# EAGLE design amc6821-breakout-v2.0 (EAGLE 9.6.2)
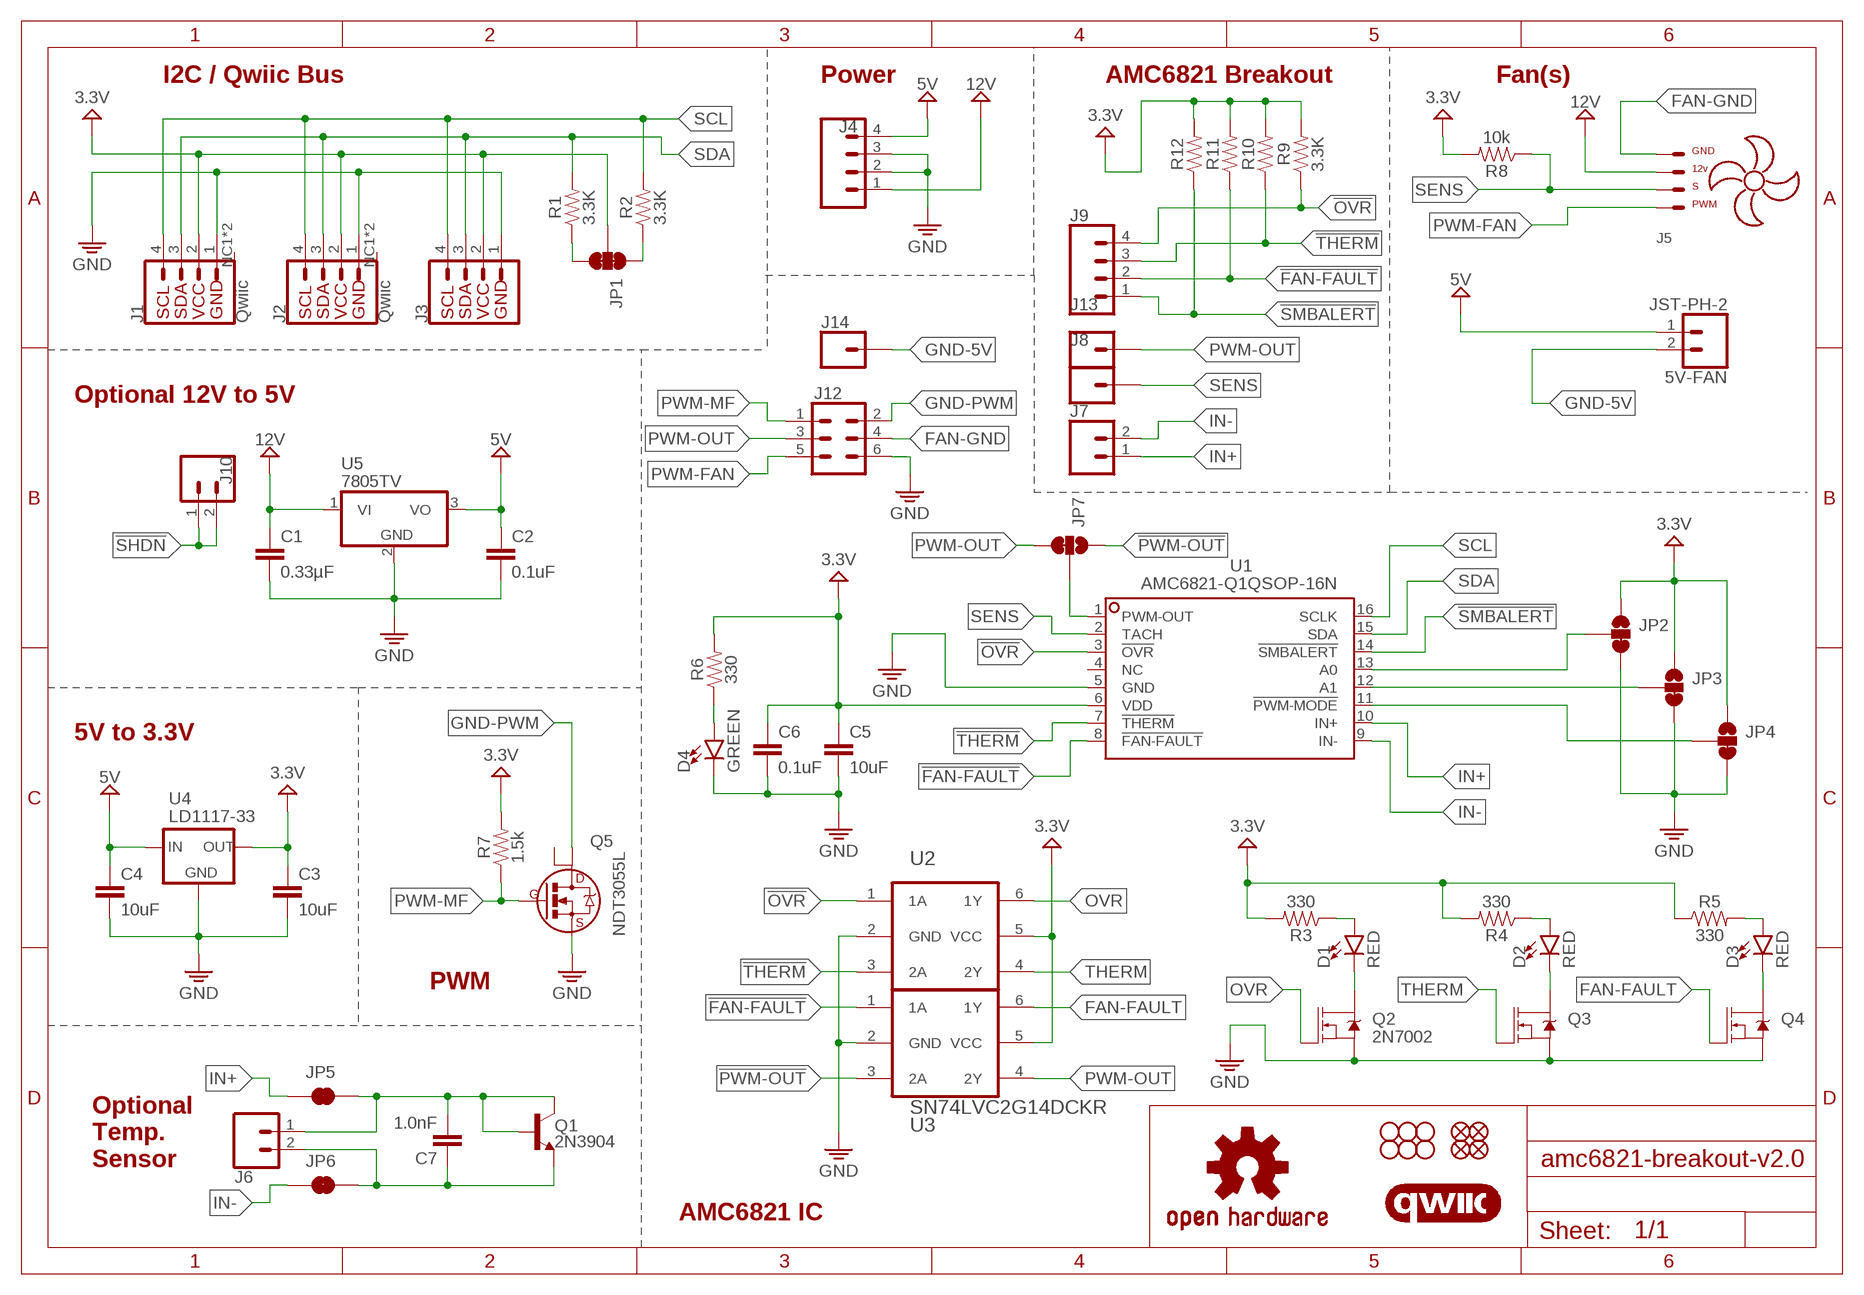
[diagram p0: schematic, sheet 1]

## Parts
5V-FAN  JST-PH-2  [JST-PH2]
C1  0.33µF  0.33UF/330NF-0805-50V-10%  [0805]
C2  0.1uF  0.1UF-0603-25V-5%  [0603]
C3  10uF  10UF-0603-6.3V-20%  [0603]
C4  10uF  10UF-0603-6.3V-20%  [0603]
C5  10uF  10UF-0603-6.3V-20%  [0603]
C6  0.1uF  0.1UF-0603-25V-5%  [0603]
C7  1.0nF  1.0NF/1000PF-0402_TIGHT-50V-10%  [0402-TIGHT]
D1  RED  LED-RED0603  [LED-0603]
D2  RED  LED-RED0603  [LED-0603]
D3  RED  LED-RED0603  [LED-0603]
D4  GREEN  LED-GREEN0603  [LED-0603]
FD1  FIDUCIALUFIDUCIAL  [FIDUCIAL-MICRO]
FD2  FIDUCIALUFIDUCIAL  [FIDUCIAL-MICRO]
FD3  FIDUCIALUFIDUCIAL  [FIDUCIAL-MICRO]
FD4  FIDUCIALUFIDUCIAL  [FIDUCIAL-MICRO]
H1  STAND-OFF  [STAND-OFF]
H2  STAND-OFF  [STAND-OFF]
H3  STAND-OFF  [STAND-OFF]
H4  STAND-OFF  [STAND-OFF]
H5  STAND-OFF  [STAND-OFF]
H6  STAND-OFF  [STAND-OFF]
J1  Qwiic  QWIIC_CONNECTOR  [JST04_1MM_VERT]
J2  Qwiic  QWIIC_CONNECTOR  [JST04_1MM_VERT]
J3  I2C_STANDARD  [1X04]
J4  CONN_04SCREW  [SCREWTERMINAL-3.5MM-4]
J5  KK-254-4KK-254  [MOLEX_47053-1000]
J6  CONN_02  [1X02]
J7  CONN_02  [1X02]
J8  CONN_01  [1X01]
J9  CONN_04PTH  [1X04]
J10  CONN_021X02_NO_SILK  [1X02_NO_SILK]
J12  CONN_03X2NO_SILK  [2X3-NS]
J13  CONN_01  [1X01]
J14  CONN_01  [1X01]
JP1  JUMPER-SMT_3_2-NC_TRACE_SILK  [SMT-JUMPER_3_2-NC_TRACE_SILK]
JP2  JUMPER-SMT_3_1-NC_TRACE_SILK  [SMT-JUMPER_3_1-NC_TRACE_SILK]
JP3  JUMPER-SMT_3_1-NC_TRACE_SILK  [SMT-JUMPER_3_1-NC_TRACE_SILK]
JP4  JUMPER-SMT_3_1-NC_TRACE_SILK  [SMT-JUMPER_3_1-NC_TRACE_SILK]
JP5  JUMPER-SMT_2_NC_TRACE_SILK  [SMT-JUMPER_2_NC_TRACE_SILK]
JP6  JUMPER-SMT_2_NC_TRACE_SILK  [SMT-JUMPER_2_NC_TRACE_SILK]
JP7  JUMPER-SMT_3_1-NC_TRACE_SILK  [SMT-JUMPER_3_1-NC_TRACE_SILK]
LOGO1  OSHW-LOGOS  [OSHW-LOGO-S]
LOGO2  QWIIC_LOGO_6MM  [QWIIC_6MM]
Q1  2N3904  TRANS_NPN-MMBTA42  [SOT23-3]
Q2  2N7002  MOSFET-NCH-2N7002PW  [SOT323]
Q3  310mA/60V/1.6Ω  MOSFET-NCH-2N7002PW  [SOT323]
Q4  310mA/60V/1.6Ω  MOSFET-NCH-2N7002PW  [SOT323]
Q5  NDT3055L  [SOT223]
R1  3.3K  RESISTOR0805  [0805]
R2  3.3K  RESISTOR0805  [0805]
R3  330  RESISTOR0805  [0805]
R4  330  RESISTOR0805  [0805]
R5  330  RESISTOR0805  [0805]
R6  330  RESISTOR0805  [0805]
R7  1.5k  1.5KOHM-0603-1/10W-1%  [0603]
R8  10k  10KOHM-0603-1/10W-1%  [0603]
R9  3.3K  RESISTOR0805  [0805]
R10  3.3K  RESISTOR0805  [0805]
R11  3.3K  RESISTOR0805  [0805]
R12  3.3K  RESISTOR0805  [0805]
U1  AMC6821-Q1QSOP-16N  [QSOP-16N]
U2  SN74LVC2G14DCKR  [SOT65P210X110-6N]
U3  SN74LVC2G14DCKR  [SOT65P210X110-6N]
U4  LD1117-33  V_REG_LD1117VXXLD1117-SMD  [SOT223]
U5  7805TV  [TO220V]

## Nets
3V3: C3.1 C5.1 C6.1 J1.2 J2.2 J3.2 JP1.2 JP2.1 JP3.1 JP4.1 R3.2 R4.2 R5.1 R6.2 R7.2 R8.2 R9.2 R10.2 R11.2 R12.2 U1.6(VDD) U2.5(VCC) U3.5(VCC) U4.2(OUT) ; supply symbol labelled 3.3V
5V: 5V-FAN.1 C2.1 C4.1 J4.4 U4.3(IN) U5.3(VO)
12V: C1.1 J4.1 J5.2:+12VDC U5.1(VI)
!FAN-FAULT: J9.2 R11.1 U1.8(!FAN-FAULT) U3.1(1A)
!OVR: J9.4 R9.1 U1.3(!OVR) U2.1(1A)
!PWM-OUT: JP7.1 U3.3(2A)
!SHDN: J10.1 J10.2
!SMBALERT: J9.1 R12.1 U1.14(!SMBALERT)
!THERM: J9.3 R10.1 U1.7(!THERM) U2.3(2A)
FAN-FAULT: Q4.1(G) U3.6(1Y)
FAN-GND: J5.1:GND J12.4
GND: C1.2 C2.2 C3.2 C4.2 C5.2 C6.2 D4.C J1.1 J2.1 J3.1 J4.2 J4.3 J12.6 JP2.3 JP3.3 JP4.3 Q2.2(S) Q3.2(S) Q4.2(S) Q5.S U1.5(GND) U2.2(GND) U3.2(GND) U4.1(GND) U5.2(GND)
GND-5V: 5V-FAN.2 J14.1
GND-PWM: J12.2 Q5.D
IN+: J7.1 JP5.1 U1.10(IN+)
IN-: J7.2 JP6.1 U1.9(IN-)
N$1: JP2.2 U1.13(A0)
N$2: C7.2 J6.1 JP5.2 Q1.1(B) Q1.3(C)
N$3: JP1.3 R1.1
N$4: JP1.1 R2.1
N$5: JP4.2 U1.11(!PWM-MODE)
N$6: JP3.2 U1.12(A1)
N$7: C7.1 J6.2 JP6.2 Q1.2(E)
N$8: D4.A R6.1
N$9: D3.A R5.2
N$10: D3.C Q4.3(D)
N$11: D1.A R3.1
N$14: D1.C Q2.3(D)
N$15: D2.C Q3.3(D)
N$16: D2.A R4.1
N$30: JP7.2 U1.1(PWM-OUT)
OVR: Q2.1(G) U2.6(1Y)
PWM-FAN: J5.4:PWM J12.5
PWM-MF: J12.1 Q5.G R7.1
PWM-OUT: J12.3 J13.1 JP7.3 U3.4(2Y)
SCL: J1.4 J2.4 J3.4 R2.2 U1.16(SCLK)
SDA: J1.3 J2.3 J3.3 R1.2 U1.15(SDA)
SENS: J5.3:TACH J8.1 R8.1 U1.2(TACH)
THERM: Q3.1(G) U2.4(2Y)
Unconnected: J1.NC1(SH) J1.NC2(SH) J2.NC1(SH) J2.NC2(SH) Q5.D2 U1.4(NC)

## Notes on the sheet
- I2C / Qwiic Bus | Power | AMC6821 Breakout | Fan(s)
- Optional 12V to 5V
- 5V to 3.3V
- PWM
- Optional
  Temp.
  Sensor
- AMC6821 IC

## Library data of the parts
5V-FAN = VinoRodrigues_Custom_Eagle:JST-PH-2
C1 = SparkFun-Capacitors:0.33UF/330NF: 0.33µF/330nF ceramic capacitors A capacitor is a passive two-terminal electrical component used to store electrical energy temporarily in an electric field.; PROD_ID: CAP-08469
C2 C6 = SparkFun-Capacitors:0.1UF: 0.1µF ceramic capacitors A capacitor is a passive two-terminal electrical component used to store electrical energy temporarily in an electric field.; PROD_ID: CAP-08604
C3-C5 = SparkFun-Capacitors:10UF: 10.0µF ceramic capacitors A capacitor is a passive two-terminal electrical component used to store electrical energy temporarily in an electric field.; PROD_ID: CAP-11015
C7 = SparkFun-Capacitors:1.0NF/1000PF: 1nF/1,000pF ceramic capacitors A capacitor is a passive two-terminal electrical component used to store electrical energy temporarily in an electric field.; PROD_ID: CAP-14280
D1-D3 = SparkFun-LED:LED-RED: Red SMD LED Used in manufacturing of most products at SparkFun Packages: 0603 - SMD 0603 package [Product Link] <http://docs.avagotech.com/docs/AV02-0551EN> 0603 SMART - SMD 0603 SMART package ( more efficient and expensive)[Product Link] <http://www.osram-os.com/Graphics/XPic2/00077099_0.pdf> 1206 - SMD1206 package [Product Link] <https://www.sparkfun.com/datasheets/DevTools/LilyPad/Q150OVS4.pdff> SparkFun Products: Pro Mini 328 -5V <https://www.sparkfun.com/products/821> RedBoard <https://www.sparkfun.com/products/12757> IOIO-OTG <https://www.sparkfun.com/products/13613>; PROD_ID: DIO-00819
D4 = SparkFun-LED:LED-GREEN: Green SMD LED Used in manufacturing of various products at SparkFun Packages: 0603 - SMD 0603 package [Product Link] <http://www.futureelectronics.com/en/technologies/semiconductors/optoelectronics/leds/Pages/9894312-LTST-C190GKT.aspx?CrossPart=HSMG-C190&IM=0> LilyPad 1206 - SMD1206 LilyPad package [Product Link] <http://www.futureelectronics.com/en/Technologies/Product.aspx?ProductID=IN150NGHARVATEKCORPORATION2049943&IM=0> 1206 - SMD1206 package [Product Link] <http://www.futureelectronics.com/en/technologies/semiconductors/optoelectronics/leds/Pages/8315665-LTST-C150KGKT.aspx?IM=0> 1206 Bottom Mount -SMD 1206 Bottom Mount [Product Link] <http://www.digikey.com/product-detail/en/lite-on-inc/LTST-C230KGKT/160-1456-1-ND/386854> SparkFun Products: Pro Mini 328 -5V <https://www.sparkfun.com/products/821> RedBoard <https://www.sparkfun.com/products/12757> MP3 Trigger <https://www.sparkfun.com/products/13720> Makey Makey <https://www.sparkfun.com/products/11076>; PROD_ID: DIO-00821
FD1-FD4 = SparkFun-Aesthetics:FIDUCIAL: Fiducial Alignment Points Point-of-reference for pick-and-place machines and other optical instruments.
H1-H6 = SparkFun-Hardware:STAND-OFF: Stand Off Drill holes for mechanically mounting via screws, standoffs, etc. Note: Use the keepout ring to avoid running the screw head into surrounding components. Variant Overviews STAND-OFF - Mechanical footprint for a #4 phillips button head screw. STAND-OFF-TIGHT - Mechanical footprint for a #4 phillips button head screw, Example SparkFun Products Screw - Phillips Head (1/4", 4-40, 10 pack) <https://www.sparkfun.com/products/10453> (PRT-10453) Screw - Phillips Head (1/2", 4-40, 10 pack) <https://www.sparkfun.com/products/10452> (PRT-10452) Screw - Phillips Head (3/4", 4-40, 10 pack) <https://www.sparkfun.com/products/10451> (PRT-10451) Screw - Phillips Head (1", 4-40, 10 pack) <https://www.sparkfun.com/products/10450> (PRT-10450)
J1 J2 = VinoRodrigues_Custom_Eagle:QWIIC_CONNECTOR: SparkFun I2C Standard Qwiic Connector An SMD 1mm pitch JST connector makes it easy and quick (get it? Qwiic?) to connect I2C devices to each other. The Qwiic system <http://www.sparkfun.com/qwiic> enables fast and solderless connection between popular platforms and various sensors and actuators. We carry 200mm <https://www.sparkfun.com/products/14204>, 100mm <https://www.sparkfun.com/products/14205>, 50mm <https://www.sparkfun.com/products/14206>, and breadboard friendly <https://www.sparkfun.com/products/14207> Qwiic cables. We also offer 10 pcs strips <https://www.sparkfun.com/products/14323> the SMD connectors.; PROD_ID: CONN-14483; VALUE: Vertical Qwiic Connector
J3 = SparkFun-Connectors:I2C_STANDARD: SparkFun I2C Standard Pinout Header SparkFun has standardized on a pinout for all I2C based sensor breakouts. This pinout allows I2C boards to be plugged directly into the headers on Arduino Uno compatible boards, and to be daisy chained easily. Example SparkFun Products: SparkFun Atmospheric Sensor Breakout - BME280 <https://www.sparkfun.com/products/13676> SparkFun Altitude/Pressure Sensor Breakout - MPL3115A2 <https://www.sparkfun.com/products/11084> SparkFun TOF Range Finder Sensor - VL6180 <https://www.sparkfun.com/products/12785>
J4 = SparkFun-Connectors:CONN_04: Multi connection point. Often used as Generic Header-pin footprint for 0.1 inch spaced/style header connections On any of the 0.1 inch spaced packages, you can populate with these: Break Away Headers - Straight <https://www.sparkfun.com/products/116> (PRT-00116) Break Away Male Headers - Right Angle <https://www.sparkfun.com/products/553> (PRT-00553) Female Headers <https://www.sparkfun.com/products/115> (PRT-00115) Break Away Headers - Machine Pin <https://www.sparkfun.com/products/117> (PRT-00117) Break Away Female Headers - Swiss Machine Pin <https://www.sparkfun.com/products/743> (PRT-00743) For SCREWTERMINALS and SPRING TERMINALS visit here: Screw Terimnals on SparkFun.com <https://www.sparkfun.com/search/results?term=Screw+Terminals> (5mm/3.5mm/2.54mm spacing) This device is also useful as a general connection point to wire up your design to another part of your project. Our various solder wires solder well into these plated through hole pads. Hook-Up Wire - Assortment (Stranded, 22 AWG) <https://www.sparkfun.com/products/11375> (PRT-11375) Hook-Up Wire - Assortment (Solid Core, 22 AWG) <https://www.sparkfun.com/products/11367> (PRT-11367) View the entire wire category on our website here <https://www.sparkfun.com/categories/141> Special notes: Molex polarized connector foot print use with SKU : PRT-08231 with associated crimp pins and housings. 1MM SMD Version SKU: PRT-10208; PROD_ID: CONN-14485
J5 = VinoRodrigues_Custom_Eagle:KK-254-4
J6 J7 J10 = SparkFun-Connectors:CONN_02: Multi connection point. Often used as Generic Header-pin footprint for 0.1 inch spaced/style header connections On any of the 0.1 inch spaced packages, you can populate with these: Break Away Headers - Straight <https://www.sparkfun.com/products/116> (PRT-00116) Break Away Male Headers - Right Angle <https://www.sparkfun.com/products/553> (PRT-00553) Female Headers <https://www.sparkfun.com/products/115> (PRT-00115) Break Away Headers - Machine Pin <https://www.sparkfun.com/products/117> (PRT-00117) Break Away Female Headers - Swiss Machine Pin <https://www.sparkfun.com/products/743> (PRT-00743) For SCREWTERMINALS and SPRING TERMINALS visit here: Screw Terimnals on SparkFun.com <https://www.sparkfun.com/search/results?term=Screw+Terminals> (5mm/3.5mm/2.54mm spacing) This device is also useful as a general connection point to wire up your design to another part of your project. Our various solder wires solder well into these plated through hole pads. Hook-Up Wire - Assortment (Stranded, 22 AWG) <https://www.sparkfun.com/products/11375> (PRT-11375) Hook-Up Wire - Assortment (Solid Core, 22 AWG) <https://www.sparkfun.com/products/11367> (PRT-11367) View the entire wire category on our website here <https://www.sparkfun.com/categories/141> Special notes: Molex polarized connector foot print use with: PRT-08233 with associated crimp pins and housings. 2.54_SCREWTERM for use with PRT-10571. 3.5mm Screw Terminal footprints for PRT-08084 5mm Screw Terminal footprints for use with PRT-08432
J8 J13 J14 = SparkFun-Connectors:CONN_01: Single connection point. Often used as Generic Header-pin footprint for 0.1 inch spaced/style header connections On any of the 0.1 inch spaced packages, you can populate with these: Break Away Headers - Straight <https://www.sparkfun.com/products/116> (PRT-00116) Break Away Male Headers - Right Angle <https://www.sparkfun.com/products/553> (PRT-00553) Female Headers <https://www.sparkfun.com/products/115> (PRT-00115) Break Away Headers - Machine Pin <https://www.sparkfun.com/products/117> (PRT-00117) Break Away Female Headers - Swiss Machine Pin <https://www.sparkfun.com/products/743> (PRT-00743) This device is also useful as a general connection point to wire up your design to another part of your project. Our various solder wires solder well into these plated through hole pads. Hook-Up Wire - Assortment (Stranded, 22 AWG) <https://www.sparkfun.com/products/11375> (PRT-11375) Hook-Up Wire - Assortment (Solid Core, 22 AWG) <https://www.sparkfun.com/products/11367> (PRT-11367) View the entire wire category on our website here <https://www.sparkfun.com/categories/141> Special notes: SMTSO-256-ET is a "flush mount" nut for a 4-40 screw. We mostly use this on specialty testbeds; it is a nice way to connect hardware to your PCB at an adjustable hieght. Also note, the SNAP packages are for using a snappable style connector. We sell a baggie of snaps and they are also used on two LilyPad designs: Snap Assortment - 30 pack (male and female) <https://www.sparkfun.com/products/11347> (DEV-11347) LilyPad Arduino SimpleSnap <https://www.sparkfun.com/products/10941> (DEV-10941) LilyPad SimpleSnap Protoboard <https://www.sparkfun.com/products/10940> (DEV-10940)
J9 = SparkFun-Connectors:CONN_04: Multi connection point. Often used as Generic Header-pin footprint for 0.1 inch spaced/style header connections On any of the 0.1 inch spaced packages, you can populate with these: Break Away Headers - Straight <https://www.sparkfun.com/products/116> (PRT-00116) Break Away Male Headers - Right Angle <https://www.sparkfun.com/products/553> (PRT-00553) Female Headers <https://www.sparkfun.com/products/115> (PRT-00115) Break Away Headers - Machine Pin <https://www.sparkfun.com/products/117> (PRT-00117) Break Away Female Headers - Swiss Machine Pin <https://www.sparkfun.com/products/743> (PRT-00743) For SCREWTERMINALS and SPRING TERMINALS visit here: Screw Terimnals on SparkFun.com <https://www.sparkfun.com/search/results?term=Screw+Terminals> (5mm/3.5mm/2.54mm spacing) This device is also useful as a general connection point to wire up your design to another part of your project. Our various solder wires solder well into these plated through hole pads. Hook-Up Wire - Assortment (Stranded, 22 AWG) <https://www.sparkfun.com/products/11375> (PRT-11375) Hook-Up Wire - Assortment (Solid Core, 22 AWG) <https://www.sparkfun.com/products/11367> (PRT-11367) View the entire wire category on our website here <https://www.sparkfun.com/categories/141> Special notes: Molex polarized connector foot print use with SKU : PRT-08231 with associated crimp pins and housings. 1MM SMD Version SKU: PRT-10208; PROD_ID: CONN-09696
J12 = SparkFun-Connectors:CONN_03X2: Multi connection point. Often used as Generic Header-pin footprint for 0.1 inch spaced/style header connections You can populate with any combo of single row headers, but if you'd like an exact match, check these: Header - 2x3 (Male, 0.1") <https://www.sparkfun.com/products/12807> (PRT-12807) Header - 2x3 (Female, 0.1") <https://www.sparkfun.com/products/13010> (PRT-13010) 2x3 Pin Shrouded Header <https://www.sparkfun.com/products/10877> (PRT-10877) On any of the 0.1 inch spaced packages, you can populate with these: Break Away Headers - Straight <https://www.sparkfun.com/products/116> (PRT-00116) Break Away Male Headers - Right Angle <https://www.sparkfun.com/products/553> (PRT-00553) Female Headers <https://www.sparkfun.com/products/115> (PRT-00115) Break Away Headers - Machine Pin <https://www.sparkfun.com/products/117> (PRT-00117) Break Away Female Headers - Swiss Machine Pin <https://www.sparkfun.com/products/743> (PRT-00743) Special note: the shrouded connector mates well with our 3x2 ribbon cables: Ribbon Crimp Connector - 6-pin (2x3, Female) <https://www.sparkfun.com/products/10651> (PRT-10651) Ribbon Cable - 6 wire (15ft) <https://www.sparkfun.com/products/10646> (PRT-10646)
JP1 = SparkFun-Jumpers:JUMPER-SMT_3_2-NC_TRACE: Normally closed trace jumper (2 of 2 connections) This jumper has a trace between all three pads so they are normally closed (NC). Use a razor knife to open the connection(s). For best results follow the IPC guidelines for cutting traces: Cutout at least 0.063 mm (0.005 in). Remove all loose material to clean up the cut area. Seal the cut with an approved epoxy. Reapply solder to reclose the connection(s).
JP2-JP4 JP7 = SparkFun-Jumpers:JUMPER-SMT_3_1-NC_TRACE: Normally closed trace jumper (1 of 2 connections) This jumper has a trace between two pads so it's normally closed (NC). The other connection is normally open (NO). Use a razor knife to open the connection. For best results follow the IPC guidelines for cutting traces: Cutout at least 0.063 mm (0.005 in). Remove all loose material to clean up the cut area. Seal the cut with an approved epoxy. Reapply solder to reclose the connection, or to close the NO connection.
JP5 JP6 = SparkFun-Jumpers:JUMPER-SMT_2_NC_TRACE: Normally closed trace jumper This jumper has a trace between two pads so it's normally closed (NC). Use a razor knife to open the connection. For best results follow the IPC guidelines for cutting traces: Cutout at least 0.063 mm (0.005 in). Remove all loose material to clean up the cut area. Seal the cut with an approved epoxy. Reapply solder to reclose the connection.
LOGO1 = SparkFun-Aesthetics:OSHW-LOGO: Open-Source Hardware (OSHW) Logo This logo indicates the piece of hardware it is found on incorporates a OSHW license and/or adheres to the definition of open source hardware found here: http://freedomdefined.org/OSHW
LOGO2 = SparkFun-Aesthetics:QWIIC_LOGO: Qwiic Logos for placement on schematic and PCB. The 5.5mm silk logo is best for placing next to Qwiic connector.
Q1 = SparkFun-DiscreteSemi:TRANS_NPN: NPN transistor Current controlled devices typically used to amplify current or used as a switch. BC547 - COM-08928 <http://www.sparkfun.com/products/8928> (TO-92 45V 100mA) (1.Collector 2.Base 3.Emitter) 2N3904 - COM-00521 <http://www.sparkfun.com/products/521> (TO-92 40V 200mA) (1.Emitter 2.Base 3.Collector) P2N2222A - COM-12852 <http://www.sparkfun.com/products/12852> (TO-92 40V 600mA) (1.Collector 2.Base 3.Emitter); PROD_ID: TRANS-09116; VALUE: 500mA/300V
Q2 = SparkFun-DiscreteSemi:MOSFET-NCH: N-channel MOSFETs Voltage controlled devices that allow control of high current outputs. SparkFun Products: SparkFun OpenScale <https://www.sparkfun.com/products/13261> SparkFun Digital Sandbox <https://www.sparkfun.com/products/12651> SparkFun Monster Moto Shield <https://www.sparkfun.com/products/10182> SparkFun MOSFET Power Controller <https://www.sparkfun.com/products/11214>; PROD_ID: TRANS-11151; VALUE: 310mA/60V/1.6Ω
Q3 Q4 = SparkFun-DiscreteSemi:MOSFET-NCH: N-channel MOSFETs Voltage controlled devices that allow control of high current outputs. SparkFun Products: SparkFun OpenScale <https://www.sparkfun.com/products/13261> SparkFun Digital Sandbox <https://www.sparkfun.com/products/12651> SparkFun Monster Moto Shield <https://www.sparkfun.com/products/10182> SparkFun MOSFET Power Controller <https://www.sparkfun.com/products/11214>; PROD_ID: TRANS-11151
Q5 = VinoRodrigues_Custom_Eagle:NDT3055L
R1-R6 R9-R12 = SparkFun-Resistors:RESISTOR: Generic Resistor Package
R7 = SparkFun-Resistors:1.5KOHM: 1.5kΩ resistor A resistor is a passive two-terminal electrical component that implements electrical resistance as a circuit element. Resistors act to reduce current flow, and, at the same time, act to lower voltage levels within circuits. - Wikipedia; PROD_ID: RES-08306
R8 = SparkFun-Resistors:10KOHM: 10kΩ resistor A resistor is a passive two-terminal electrical component that implements electrical resistance as a circuit element. Resistors act to reduce current flow, and, at the same time, act to lower voltage levels within circuits. - Wikipedia; PROD_ID: RES-00824
U1 = VinoRodrigues_Custom_Eagle:AMC6821-Q1: AMC6821 www.ti.com/product/AMC6821
U2 U3 = VinoRodrigues_Custom_Eagle:SN74LVC2G14DCKR: DUAL SCHMITT-TRIGGER INVERTER; MPN: SN74LVC2G14DCKR; OC_FARNELL: 1470885; OC_NEWARK: 76C4204; PACKAGE: SOT-23-6; SUPPLIER: Texas Instruments
U4 = SparkFun-IC-Power:V_REG_LD1117VXX: LD1117VXX voltage regulator. We carry the 3.3V version (COM-00526) in TO-220 package.; PROD_ID: VREG-13917
U5 = linear:78*: Positive VOLTAGE REGULATOR Source: http://cache.national.com/ds/LM/LM78L05.pdf http://www.fairchildsemi.com/ds/LM/LM7805.pdf

## Board
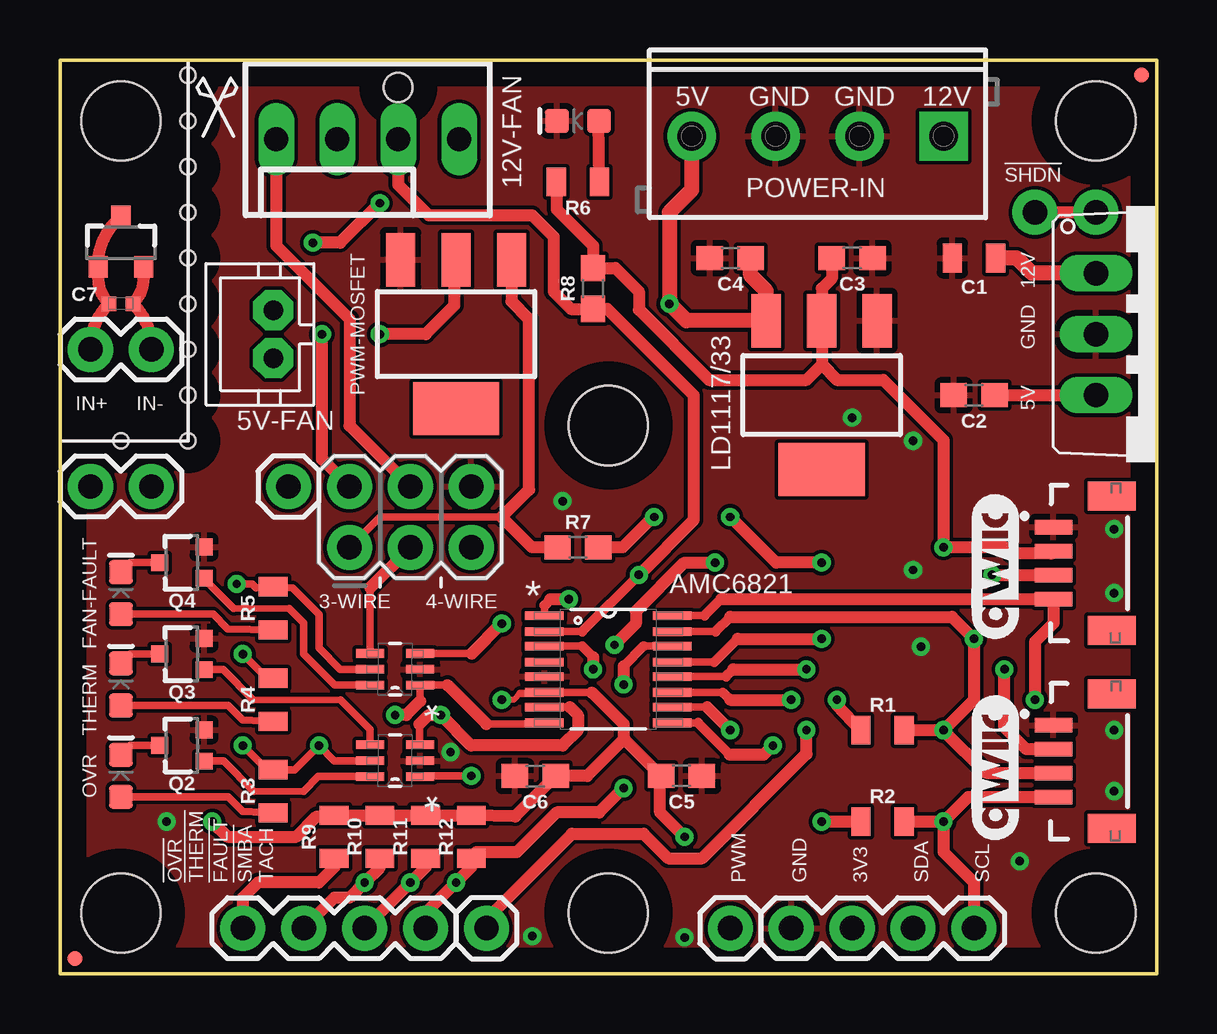
[diagram p1: board, top side]
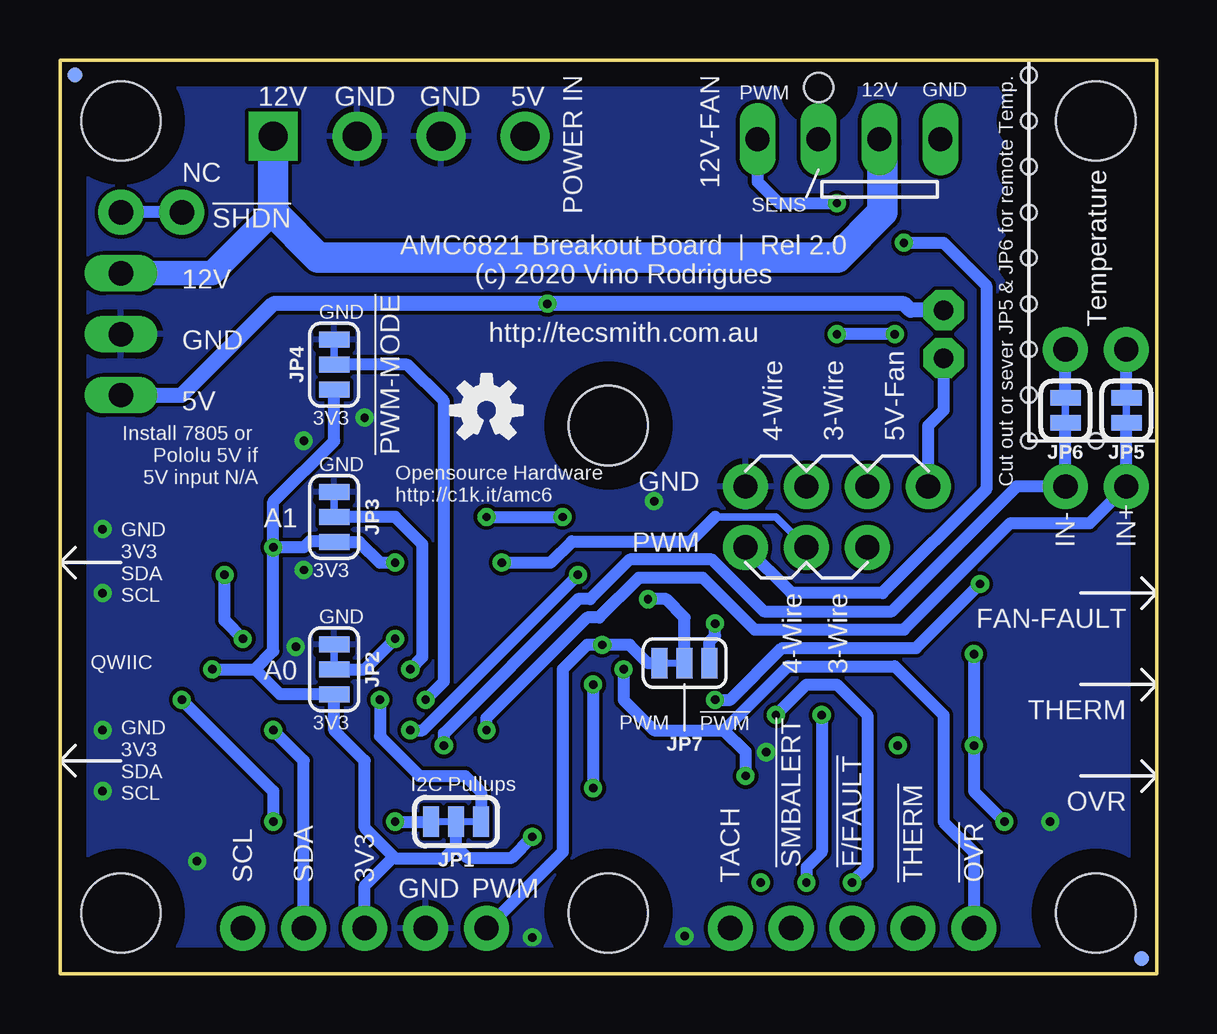
[diagram p2: board, bottom side, seen from below]

Size 45.72 x 38.1 mm. Coordinates in mm from the lower left corner, seen from the top.
Outline: 45.72,38.1 45.72,0 0,0 0,38.1 45.72,38.1
Copper layers (1*16): Top 0.035mm / dielectric 1.5mm / Bottom 0.035mm
Design rules "default": minimum track width 6mil, minimum drill 0.35mm, track to track 6mil, track to pad 6mil, pad to pad 6mil, via to via 6mil, smd to smd 6mil, copper to edge 40mil, drill to drill 6mil, minimum pad ring 10mil, minimum via ring 8mil, stop-mask expansion 4mil, vias tented up to drill 0mil, thermal gap 10mil
Holes 0.64 mm at 5.33,37.47 5.33,35.56 5.33,33.66 5.33,31.75 5.33,29.84 5.33,27.94 5.33,26.04 5.33,24.13 5.33,22.23 2.54,22.23

### Footprints (pad centres in the part's own frame; a part is rotated, then mirrored left to right if it is on the bottom)
JST-PH2 = drill 0.813 pad 1.676 octagon: 1 1,0; 2 -1,0
0805 = smd 0.8 x 1.2: 1 -0.9,0; 2 0.9,0
0603 = smd 1.1 x 1: 1 -0.85,0; 2 0.85,0
0402-TIGHT = smd 0.6 x 0.6: 1 -0.5,0; 2 0.5,0
LED-0603 = smd 1 x 1: A -0.877,0; C 0.877,0
FIDUCIAL-MICRO = smd 0.635 x 0.635: 1 0,0
STAND-OFF = hole 3.302: 0,0
JST04_1MM_VERT = smd 0.6 x 1.55: 1 -1.478,0.775; 2 -0.478,0.775; 3 0.522,0.775; 4 1.522,0.775 | smd 1.2 x 2: NC1 -2.778,3.2; NC2 2.822,3.2
1X04 = drill 1.016 pad 1.88: 1 0,0; 2 2.54,0; 3 5.08,0; 4 7.62,0
SCREWTERMINAL-3.5MM-4 = drill 1.2 pad 2.032 square: 1 0,0 | drill 1.2 pad 2.032: 2 3.5,0; 3 7,0; 4 10.5,0
MOLEX_47053-1000 = drill 1 long: 1:GND 3.81,0; 2:+12VDC 1.27,0; 3:TACH -1.27,0; 4:PWM -3.81,0 | hole 1.2: -1.27,-2.159
1X02 = drill 1.016 pad 1.88: 1 0,0; 2 2.54,0
1X01 = drill 1.016 pad 1.88: 1 0,0
1X02_NO_SILK = drill 1.016 pad 1.88: 1 0,0; 2 2.54,0
2X3-NS = drill 1.016 pad 1.88: 1 -2.54,-1.27; 2 -2.54,1.27; 3 0,-1.27; 4 0,1.27; 5 2.54,-1.27; 6 2.54,1.27
SMT-JUMPER_3_2-NC_TRACE_SILK = smd 0.66 x 1.27: 1 -1.041,0; 2 0,0; 3 1.041,0
SMT-JUMPER_3_1-NC_TRACE_SILK = smd 0.66 x 1.27: 1 -1.041,0; 2 0,0; 3 1.041,0
SMT-JUMPER_2_NC_TRACE_SILK = smd 0.66 x 1.27: 1 -0.521,0; 2 0.521,0
SOT23-3 = smd 0.8 x 0.9: 1 -0.95,-1; 2 0.95,-1; 3 0,1.1
SOT323 = smd 0.7 x 0.7: 1 -0.65,-0.925; 2 0.65,-0.925; 3 0,0.925
SOT223 = smd 1.219 x 2.235: D 0,-3.099; G -2.311,-3.099; S 2.311,-3.099 | smd 3.6 x 2.2: D2 0,3.099
QSOP-16N = smd 1.6 x 0.356: 1 -2.667,2.235; 2 -2.667,1.575; 3 -2.667,0.965; 4 -2.667,0.305; 5 -2.667,-0.305; 6 -2.667,-0.965; 7 -2.667,-1.575; 8 -2.667,-2.235; 9 2.667,-2.235; 10 2.667,-1.575; 11 2.667,-0.965; 12 2.667,-0.305; 13 2.667,0.305; 14 2.667,0.965; 15 2.667,1.575; 16 2.667,2.235
SOT65P210X110-6N = smd 1.168 x 0.356: 1 -1.041,0.66; 2 -1.041,0; 3 -1.041,-0.66; 4 1.041,-0.66; 5 1.041,0; 6 1.041,0.66
SOT223' = smd 1.219 x 2.235: 1 -2.311,-3.099; 2 0,-3.099; 3 2.311,-3.099 | smd 3.6 x 2.2: 4 0,3.099
TO220V = drill 1.016 long: 1 -2.54,-2.54; 2 0,-2.54; 3 2.54,-2.54

### Placement (x,y rotation side)
5V-FAN  8.89,26.67 90 top
C1  38.1,29.84 180 top
C2  38.1,24.13 180 top
C3  33.02,29.84 0 top
C4  27.94,29.84 180 top
C5  25.91,8.26 0 top
C6  19.81,8.26 180 top
C7  2.54,27.94 180 top
D1  2.54,8.26 90 top
D2  2.54,12.06 90 top
D3  2.54,15.88 90 top
D4  21.59,35.56 180 top
FD1  0.64,0.64 0 top
FD2  0.64,0.64 0 bottom
FD3  45.09,37.47 0 top
FD4  45.09,37.47 0 bottom
H1  2.54,2.54 0 top
H2  43.18,2.54 0 top
H3  2.54,35.56 0 top
H4  43.18,35.56 0 top
H5  22.86,2.54 0 top
H6  22.86,22.86 0 top
J1  40.64,8.89 270 top
J2  40.64,17.14 270 top
J3  30.48,1.91 0 top
J4  36.83,34.92 180 top
J5  12.83,34.8 180 top
J6  1.27,26.04 0 top
J7  1.27,20.32 0 top
J8  17.78,1.91 0 top
J9  15.24,1.91 180 top
J10  43.18,31.75 0 bottom
J12  14.61,19.05 0 top
J13  27.94,1.91 0 top
J14  9.53,20.32 90 top
JP1  29.21,6.35 0 bottom
JP2  34.29,12.7 90 bottom
JP3  34.29,19.05 90 bottom
JP4  34.29,25.4 90 bottom
JP5  1.27,23.5 90 bottom
JP6  3.81,23.5 90 bottom
JP7  19.68,12.95 180 bottom
LOGO1  27.94,23.5 0 bottom
LOGO2  38.99,17.02 90 top
LOGO5  QWIIC_LOGO_6MM  [QWIIC_6MM]  38.99,8.64 90 top
Q1  2.54,30.48 0 top
Q2  5.08,9.53 90 top
Q3  5.08,13.34 90 top
Q4  5.08,17.14 90 top
Q5  16.51,26.67 180 top
R1  34.29,10.16 0 top
R2  34.29,6.35 0 top
R3  8.89,7.62 90 top
R4  8.89,11.43 90 top
R5  8.89,15.24 270 top
R6  21.59,33.02 180 top
R7  21.59,17.78 0 top
R8  22.23,28.57 90 top
R9  11.43,5.71 90 top
R10  13.34,5.71 90 top
R11  15.24,5.71 90 top
R12  17.14,5.71 90 top
U1  22.86,12.7 0 top
U2  13.97,8.89 180 top
U3  13.97,12.7 180 top
U4  LD1117-33  [SOT223']  31.75,24.13 180 top
U5  45.72,26.67 270 top

### Tracks (layer width: path | path; a pad name or v marks a point on that pad's centre or on a via)
3V3  (via drill 0.35)
  Top 0.203: C5.1 25.02,8.26 | 10.71,6.57 10.79,6.57
  Top 0.254: J2.2 41.32,17.53 | v24.77,19.05 24.73,19.05 | 23.5,9.78 23.53,9.78 | U1.6 20.14,11.68 | 19.18,11.68 18.92,11.43 v18.41,11.43 | 8.93,8.51 R3.2 8.68,8.47 | 8.68,12.28 R4.2 | R6.2 20.7,32.98
  Top 0.305: U2.5 11.43,8.89 v10.79,9.53 9.78,8.51 8.93,8.51 | U1.6 22.17,11.73 | 20.14,11.68 19.18,11.68 | U3.5 11.68,12.7 10.79,13.59 10.79,14.99 9.69,16.09 R5.1 8.17,16.09 8,16.26 v7.37,16.26 | v7.62,9.53 8.68,8.47 | v7.62,13.34 8.68,12.28
  Top 0.508: C3.1 32.17,29 31.75,28.57 U4.2 31.75,25.4 | 31.75,25.4 31.11,24.77 27.05,24.77 24.13,27.69 24.13,28.45 23.15,29.43 R8.2 22.23,30.35 20.7,31.88 20.7,32.98 | 31.75,25.4 32.38,24.77 34.31,24.77 36.83,22.25 v36.83,17.78 39.37,17.78 39.62,17.53 41.32,17.53 | J1.2 40.29,9.37 39.37,10.29 v39.37,12.7 | 25.02,8.26 25.02,6.73 v26.04,5.71 | v31.75,17.14 29.84,17.14 v27.94,19.05 | 24.73,19.05 23.46,17.78 R7.2 | 22.17,11.73 23.5,10.41 23.5,9.78 21.97,8.26 C6.1 18.97,6.57 R12.2 R11.2 R10.2 R9.2 10.79,6.57 | 23.53,9.78 C5.1 | v6.35,6.35 6.99,5.71 9.86,5.71 10.71,6.57
  Bottom 0.254: 31.75,4.83 31.88,4.83 | JP3.1 34.31,18.03
  Bottom 0.508: v7.62,13.34 v7.62,9.53 7.62,7.62 v6.35,6.35 | v36.83,17.78 36.83,19.68 34.29,22.23 JP4.1 | 37.59,12.7 36.83,13.46 v36.83,17.78 | v39.37,12.7 37.59,12.7 | 37.59,12.7 36.55,11.66 JP2.1 34.29,10.16 33.02,8.89 33.02,6.1 31.75,4.83 29.72,4.83 29.21,5.33 | J3.2 33.02,3.68 31.88,4.83 | 29.21,5.33 JP1.2 | v26.04,5.71 26.92,4.83 28.7,4.83 29.21,5.33 | 34.31,18.03 35.31,18.03 35.56,17.78 v36.83,17.78 | JP3.1 33.25,18.01 32.38,17.14 v31.75,17.14 | v27.94,19.05 v24.77,19.05 | v18.41,11.43 17.78,11.43 15.62,13.59 10.03,13.59 v7.37,16.26
5V  (via drill 0.35)
  Top 0.508: C2.1 U5.3
  Top 0.635: J4.4 26.33,32.68 25.4,31.75 v25.4,27.94 26.11,27.23 U4.3 29.44,28.47 28.79,29.12 C4.1
  Bottom 0.635: U5.3 40.64,24.13 36.83,27.94 v25.4,27.94 10.54,27.94 10.27,27.67 5V-FAN.1
12V
  Top 0.635: C1.1 39.88,29.84 40.51,29.21 U5.1
  Bottom 0.762: 11.43,34.67 J5.2:+12VDC
  Bottom 1.016: U5.1 39.37,29.21 36.83,31.75
  Bottom 1.27: 11.43,34.67 11.43,31.75 13.31,29.87 34.95,29.87 36.83,31.75 J4.1
!FAN-FAULT  (via drill 0.35)
  Top 0.203: 20.14,10.41 U1.8
  Top 0.305: 16.15,12.04 U3.1 15.01,11.38 | 17.78,10.41 20.14,10.41
  Top 0.508: 16.15,12.04 17.78,10.41 | 15.01,11.38 14.43,10.79 v13.97,10.79 | R11.1 15.24,4.45 v14.61,3.81 J9.2
  Bottom 0.508: v13.97,10.79 13.97,5.08 14.61,4.45 v14.61,3.81
!OVR  (via drill 0.35)
  Top 0.203: U2.1 15.04,8.26
  Top 0.305: U1.3 21.77,13.66 | v17.14,8.26 15.04,8.26
  Top 0.406: 22.23,13.21 21.77,13.66
  Top 0.508: 22.23,13.21 v22.23,12.7 | R9.1 11.43,4.45 10.79,3.81 8.26,3.81 7.62,3.17 J9.4
  Bottom 0.508: J9.4 7.62,5.08 8.89,6.35 8.89,10.79 10.92,12.83 15.37,12.83 18.03,10.16 | v22.23,12.7 22.23,11.43 20.95,10.16 18.03,10.16 | 18.03,10.16 17.14,9.27 v17.14,8.26
!PWM-OUT  (via drill 0.35)
  Top 0.305: U3.3 17.17,13.36
  Top 0.508: 17.17,13.36 v18.41,14.61
  Bottom 0.508: JP7.1 18.64,13.87 18.41,14.1 v18.41,14.61
!SHDN
  Top 0.508: J10.2 J10.1
  Bottom 0.508: J10.2 J10.1
!SMBALERT  (via drill 0.35)
  Top 0.203: R12.1 17.36,5.08
  Top 0.305: U1.14 24.33,13.66
  Top 0.406: 24.33,13.66 23.5,12.83
  Top 0.508: 23.5,12.83 v23.5,12.06 | v23.5,7.75 22.48,6.73 20.7,6.73 19.05,5.08 17.36,5.08 | R12.1 17.14,4.45 v16.51,3.81 15.24,2.54 J9.1
  Bottom 0.508: v23.5,12.06 v23.5,7.75
!THERM  (via drill 0.35)
  Top 0.203: U2.3 14.99,9.58
  Top 0.305: U1.7 21.26,11.12 | 14.99,9.58 14.99,10.41
  Top 0.508: 21.26,11.12 21.59,10.79 21.59,10.16 20.95,9.53 17.14,9.53 v15.88,10.79 15.37,10.79 14.99,10.41 | R10.1 13.34,4.45 v12.7,3.81 12.06,3.17 11.43,3.17 J9.3
  Bottom 0.508: v15.88,10.79 14.61,12.06 13.34,12.06 12.06,10.79 12.06,4.45 v12.7,3.81
FAN-FAULT
  Top 0.203: Q4.1 6,16.47
  Top 0.279: 9.56,15.23 7.25,15.23
  Top 0.305: U3.6 11.46,12.04 10.15,13.34 10.15,14.64 9.56,15.23 | 7.25,15.23 6,16.47
FAN-GND
  Top 0.508: J5.1:GND 9.02,30.35 12.06,27.3 12.06,22.86 J12.4
GND  (via drill 0.35)
  other vias: 43.94,18.54 43.94,15.88 43.94,10.16 43.94,7.62 4.45,6.35 20.95,19.71 40.01,4.7 26.04,1.52 35.89,13.64 35.56,16.84 33.02,23.19 35.56,22.23 16.28,9.25 19.68,1.57
  pour Top: 45.72,0 0,0 0,21.59 5.33,21.59 5.33,38.1 45.72,38.1
  pour Bottom: 45.72,0 0,0 0,21.59 5.33,21.59 5.33,38.1 45.72,38.1
GND-5V
  Bottom 0.508: J14.1 9.53,22.86 8.89,23.5 5V-FAN.2
GND-PWM  (via drill 0.35)
  Top 0.203: Q5.D 16.43,29.77
  Top 0.508: 16.43,29.77 16.43,27.86 15.24,26.67 v13.34,26.67 | J12.2 10.92,21.46 v10.92,26.67
  Bottom 0.508: v10.92,26.67 v13.34,26.67
IN+  (via drill 0.35)
  Top 0.305: U1.10 26.98,11.12
  Top 0.508: 26.98,11.12 v27.94,10.16
  Bottom 0.508: v27.94,10.16 27.94,10.67 23.75,14.86 23.24,14.86 21.59,16.51 18.92,16.51 16.76,14.35 10.54,14.35 6.1,18.8 2.79,18.8 J7.1 JP5.1
IN-  (via drill 0.35)
  Top 0.305: U1.9 26.59,10.46
  Top 0.406: 26.59,10.46 27.91,9.14
  Top 0.508: 27.91,9.14 29.34,9.14 v29.72,9.53
  Bottom 0.508: v29.72,9.53 29.72,10.03 24.13,15.62 23.62,15.62 21.97,17.27 18.54,17.27 16.38,15.11 11.05,15.11 5.84,20.32 J7.2 JP6.1
N$1  (via drill 0.35)
  Top 0.305: U1.13 27.28,13.01
  Top 0.406: 27.28,13.01 28.25,13.97
  Top 0.508: 28.25,13.97 v31.75,13.97
  Bottom 0.508: JP2.2 33.02,12.7 v31.75,13.97
N$2
  Top 0.203: Q1.1 1.59,29.03 | C7.2 2.01,27.91 | 1.27,26.12 J6.1
  Top 0.508: 1.59,29.03 arc45 C7.2 | 2.01,27.91 arc45 1.27,26.12 | Q1.1 1.59,29.58 arc-45 2.33,31.37 Q1.3
  Bottom 0.508: JP5.2 J6.1
N$3  (via drill 0.35)
  Top 0.203: 32.38,11.21 v32.38,11.43
  Top 0.508: R1.1 32.38,11.21
  Bottom 0.508: v32.38,11.43 32.38,9.91 30.73,8.26 28.83,8.26 28.17,7.59 JP1.3
N$4  (via drill 0.35)
  Top 0.508: R2.1 v31.75,6.35
  Bottom 0.508: v31.75,6.35 JP1.1
N$5  (via drill 0.35)
  Top 0.305: U1.11 27.64,11.73
  Top 0.406: 27.64,11.73 27.94,11.43
  Top 0.508: 27.94,11.43 v30.48,11.43
  Bottom 0.508: v30.48,11.43 29.72,12.19 29.72,23.88 31.24,25.4 JP4.2
N$6  (via drill 0.35)
  Top 0.305: U1.12 27.76,12.39
  Top 0.406: 27.76,12.39 28.07,12.7
  Top 0.508: 28.07,12.7 v31.11,12.7
  Bottom 0.508: v31.11,12.7 30.61,13.21 30.61,17.91 31.75,19.05 JP3.2
N$7
  Top 0.203: 3.49,29.03 Q1.2 | C7.1 3.07,27.91 | 3.81,26.12 J6.2
  Top 0.508: C7.1 arc45 3.49,29.03 | 3.07,27.91 arc-45 3.81,26.12
  Bottom 0.508: JP6.2 J6.2
N$8
  Top 0.203: 22.44,35.53 D4.A
  Top 0.508: R6.1 22.44,35.53
N$9
  Top 0.305: R5.2 6.99,14.39 6.38,15 D3.A
N$10
  Top 0.305: D3.C 2.93,17.14 Q4.3
N$11
  Top 0.305: R3.1 7.62,6.77 7.01,7.38 D1.A
N$14
  Top 0.305: D1.C 2.93,9.53 Q2.3
N$15
  Top 0.305: D2.C 2.93,13.34 Q3.3
N$16
  Top 0.305: R4.1 7.62,10.58 7.01,11.19 D2.A
N$30  (via drill 0.35)
  Top 0.305: U1.1 20.19,15.37
  Top 0.406: 20.19,15.37 20.45,15.62
  Top 0.508: 20.45,15.62 v21.21,15.62
  Bottom 0.508: JP7.2 19.68,14.86 20.45,15.62 v21.21,15.62
OVR
  Top 0.279: 10.16,7.62 8.08,7.62
  Top 0.305: U2.6 10.77,8.23 10.16,7.62 | Q2.1 6.82,8.88 8.08,7.62
PWM-FAN  (via drill 0.35)
  Top 0.508: v13.34,32.13 11.68,30.48 v10.54,30.48
  Bottom 0.508: J5.4:PWM 16.64,33.02 15.75,32.13 v13.34,32.13 | v10.54,30.48 8.89,30.48 7.11,28.7 7.11,20.19 11.43,15.88 15.24,15.88 J12.5
PWM-MF
  Top 0.305: 18.41,19.05 13.34,19.05 J12.1
  Top 0.508: Q5.G 18.82,28.04 19.56,27.3 19.56,20.19 18.41,19.05 19.68,17.78 R7.1
PWM-OUT  (via drill 0.35)
  Top 0.305: U3.4 12.93,16.1
  Top 0.508: 12.93,16.1 J12.3 | v23.11,13.72 24,14.61 24,15.11 26.04,17.14 v27.3,17.14
  Bottom 0.305: 18.41,19.05 15.88,19.05 J12.3
  Bottom 0.508: JP7.3 21.21,12.95 21.97,13.72 v23.11,13.72 23.75,13.72 24.77,12.7 24.77,5.08 J13.1 | v27.3,17.14 25.27,17.14 24.38,18.03 19.43,18.03 18.41,19.05
SCL  (via drill 0.35)
  Top 0.203: J1.4
  Top 0.305: U1.16 26.87,14.94
  Top 0.406: 26.87,14.94 27.56,15.62
  Top 0.508: 27.56,15.62 J2.4 41.41,14.62 40.64,13.84 v40.64,11.43 | v36.83,6.35 R2.2 | J1.4 37.85,7.37 v36.83,6.35 | J3.4 38.1,3.81 36.83,5.08 v36.83,6.35
  Bottom 0.508: v40.64,11.43 36.83,7.62 v36.83,6.35
SDA  (via drill 0.35)
  Top 0.203: 41.4,8.38 J1.3 | 41.4,16.64 J2.3
  Top 0.305: U1.15 27.33,14.28
  Top 0.406: 27.33,14.28 27.94,14.88
  Top 0.508: v38.86,16.64 41.4,16.64 | 27.94,14.88 37.19,14.88 v38.1,13.97 38.1,11.43 v36.83,10.16 | v36.83,10.16 R1.2 | v36.83,10.16 38.61,8.38 41.4,8.38
  Bottom 0.508: v38.86,16.64 38.86,14.73 v38.1,13.97 | J3.3 35.56,8.89 v36.83,10.16
SENS  (via drill 0.35)
  Top 0.305: 21.77,14.28 U1.2
  Top 0.406: v24.13,16.64 21.77,14.28
  Top 0.508: J5.3:TACH 14.1,32.89 15.37,31.62 19.68,31.62 20.57,30.73 20.57,28.45 21.3,27.73 R8.1 22.82,27.73 26.42,24.13 26.42,18.92 v24.13,16.64 | J8.1 17.78,2.29 21.34,5.84 24.33,5.84 25.35,4.83 26.77,4.83 31.11,9.17 v31.11,10.16
  Bottom 0.508: v31.11,10.16 30.61,10.16 v24.13,16.64
THERM
  Top 0.279: 11.69,11.43 8.06,11.43
  Top 0.305: Q3.1 6.8,12.69 8.06,11.43 | U2.4 12.93,10.19 11.69,11.43

### Text on the board
tPlace: !SHDN | 12V | GND | IN+ | IN- | 5V | 3-WIRE | 4-WIRE | !OVR | !THERM | !FAULT | !SMBA | TACH | PWM | GND | 3V3 | SDA | SCL
bPlace: Cut out or sever JP5 & JP6 for remote Temp. | GND | 12V | 12V-FAN | POWER IN | PWM | 5V | GND | GND | 12V | Temperature | NC | SENS | !SHDN | AMC6821 Breakout Board | Rel 2.0 / (c) 2020 Vino Rodrigues / / http://tecsmith.com.au | 12V | !PWM-MODE | GND | Install 7805 or / Pololu 5V if / 5V input N/A | 5V | 5V-Fan | 3-Wire | 4-Wire | GND | Opensource Hardware / http://c1k.it/amc6 | A1 | IN+ | IN- | PWM | 3-Wire | 4-Wire | FAN-FAULT | GND / 3V3 / SDA / SCL | A0 | QWIIC | THERM | OVR | I2C Pullups | GND / 3V3 / SDA / SCL | !OVR | !THERM | !F/FAULT | !SMBALERT | TACH | 3V3 | SDA | SCL | PWM | GND
tNames: 12V-FAN | 5V | GND | GND | 12V | POWER-IN | PWM-MOSFET | 5V-FAN | LD1117/33 | FAN-FAULT | AMC6821 | THERM | OVR
bNames: GND | 3V3 | GND | 3V3 | GND | PWM | 3V3 | !PWM